# EAGLE board EtherTenR3 (EAGLE 6.2)
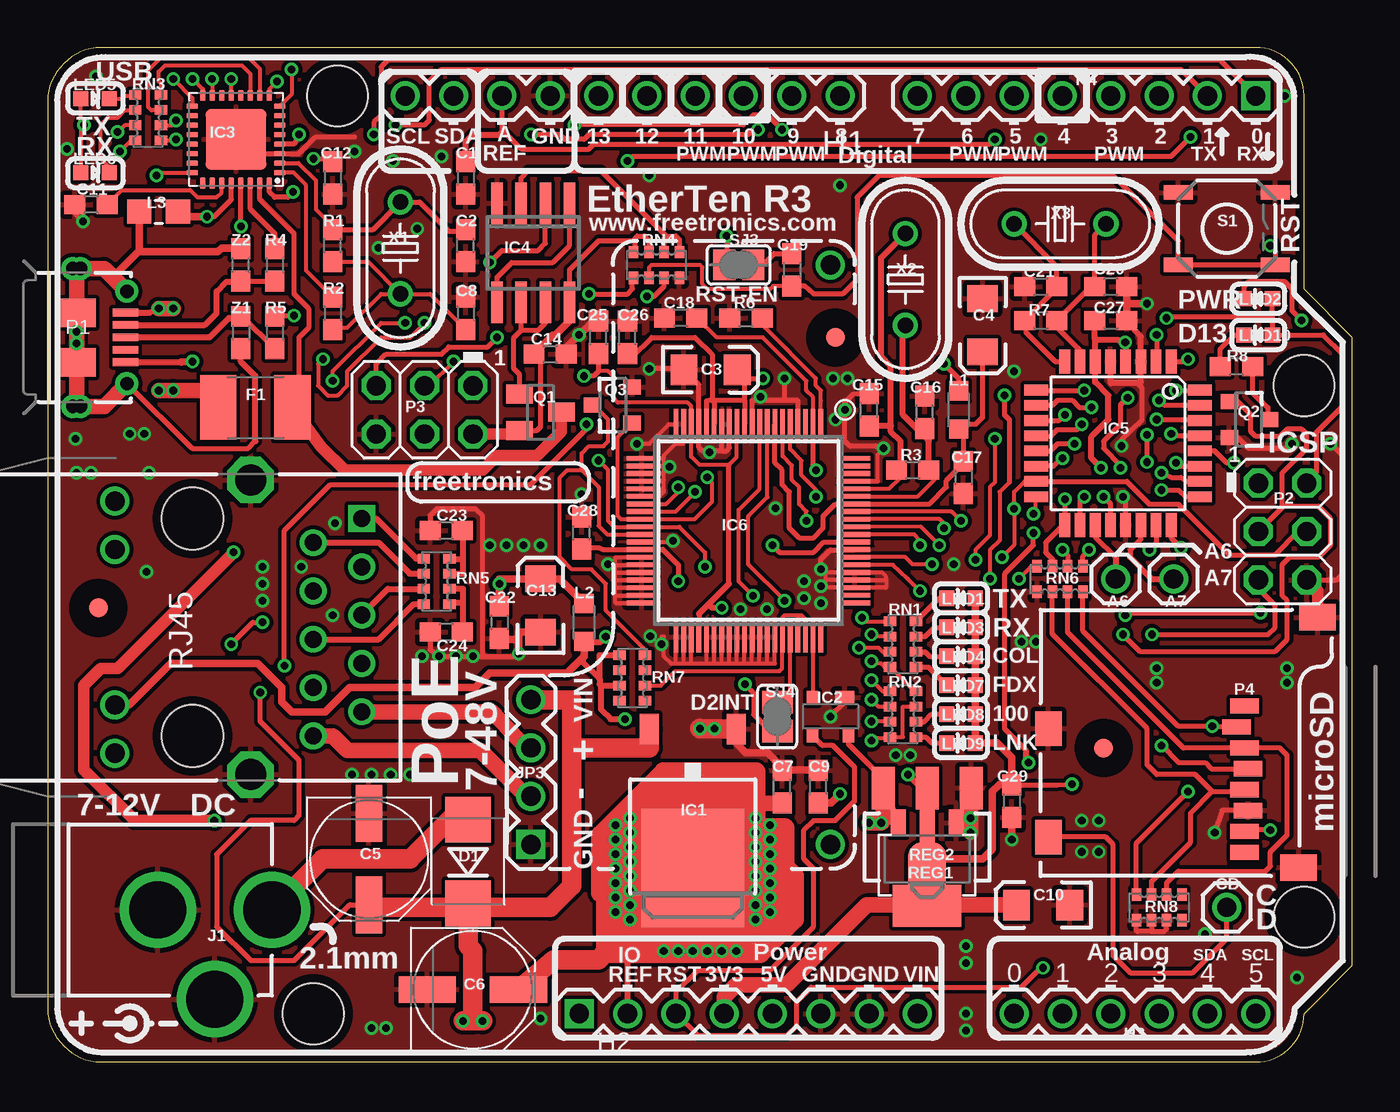
[diagram p1: board, top side]
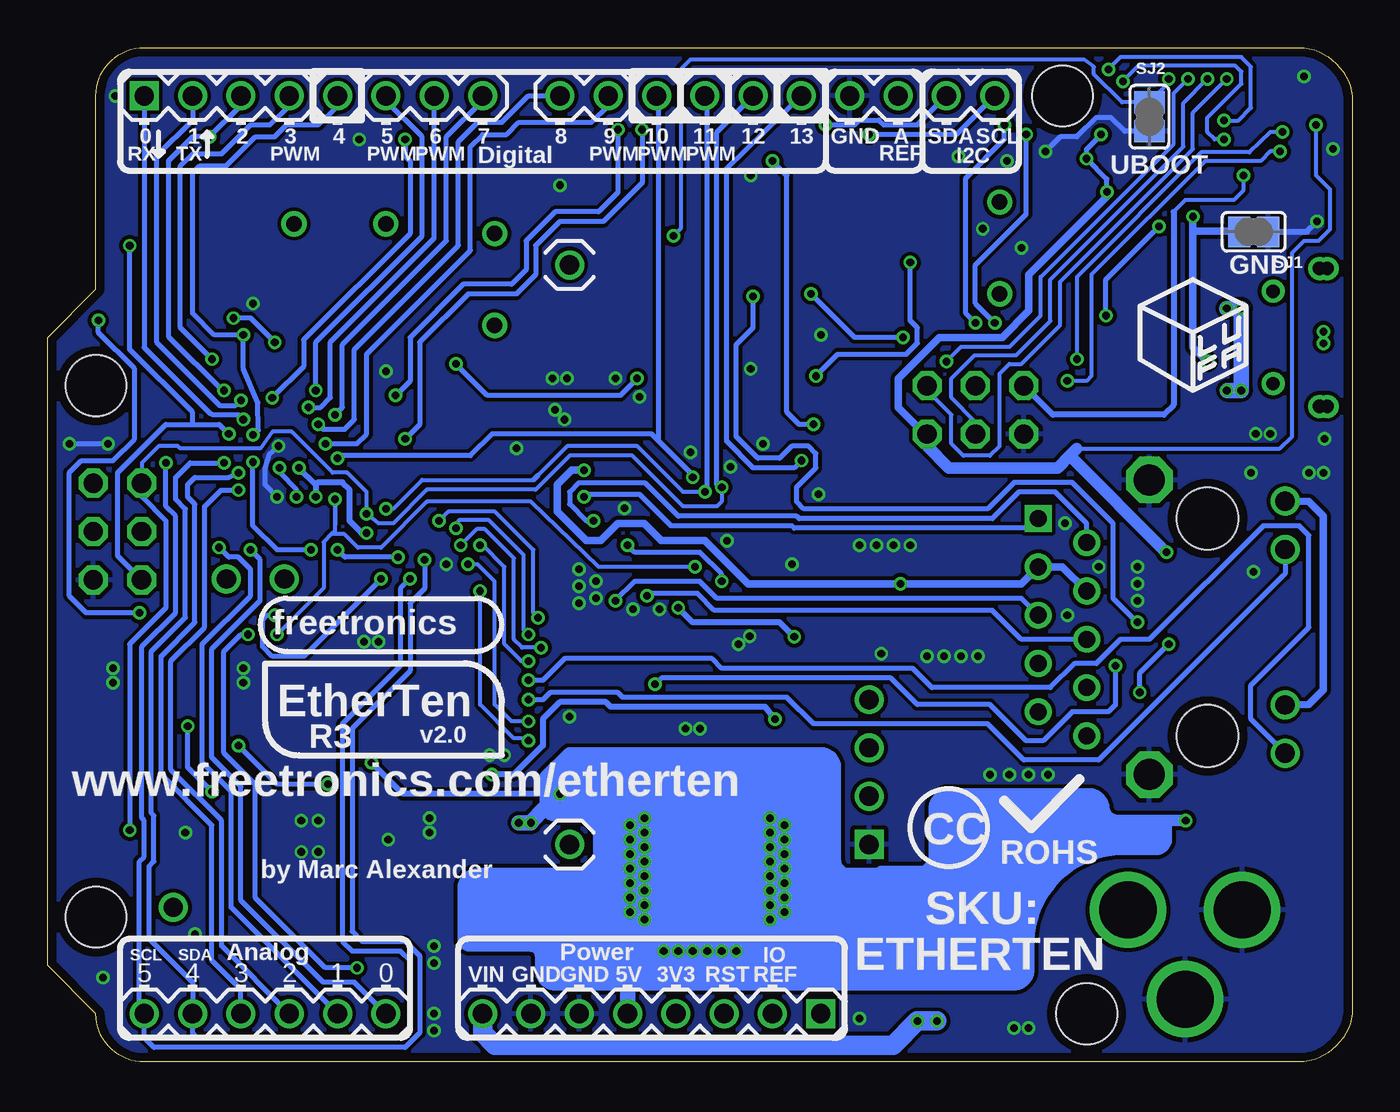
[diagram p2: board, bottom side, seen from below]

Size 68.58 x 53.34 mm. Coordinates in mm from the lower left corner, seen from the top.
Outline: 0,2.54 arc74 2.54,0 63.5,0 arc90 66.04,2.54 68.58,5.08 68.58,38.1 66.04,40.64 66.04,50.8 arc90 63.5,53.34 2.54,53.34 arc74 0,50.8 0,2.54
Copper layers (1*16): Top 0.035mm / dielectric 1.5mm / Bottom 0.035mm
Design rules: minimum track width 8mil, minimum drill 15mil, track to track 8mil, track to pad 8mil, pad to pad 8mil, via to via 8mil, smd to smd 8mil, copper to edge 18mil, drill to drill 8mil, minimum pad ring 10mil, minimum via ring 6mil, stop-mask expansion 4mil, vias tented up to drill 25mil, thermal gap 10mil
Holes 3.2 mm at 66.04,35.56 66.04,7.62 13.97,2.54 15.24,50.8
tRestrict: area 40.4,37.1 to 42.4,39.1; area 54.5,15.5 to 56.5,17.5; area 1.7,22.9 to 3.7,24.9

## Footprints (pad centres in the part's own frame; a part is rotated, then mirrored left to right if it is on the bottom)
1X01 = drill 1.016: 1 0,0
0603 = smd 1.1 x 1: 1 -0.85,0; 2 0.85,0
EIA3216 = smd 1.4 x 1.6: A 1.4,0; C -1.4,0
PANASONIC_D = smd 3 x 1.4: + 2.4,0; - -2.4,0
SMB-DIODE = smd 2.4 x 2.4: A 2.2,0; C -2.2,0
L1812 = smd 1.9 x 3.4: 1 -1.95,0; 2 1.95,0
FIDUCIAL-1X2.5 = smd 1 x 1: 1 0,0
1X10 = drill 1.016: 1 0,0; 2 2.54,0; 3 5.08,0; 4 7.62,0; 5 10.16,0; 6 12.7,0; 7 15.24,0; 8 17.78,0; 9 20.32,0; 10 22.86,0
1X08 = drill 1.016 square: 1 0,0 | drill 1.016: 2 2.54,0; 3 5.08,0; 4 7.62,0; 5 10.16,0; 6 12.7,0; 7 15.24,0; 8 17.78,0
1X06 = drill 1.016: 1 0,0; 2 2.54,0; 3 5.08,0; 4 7.62,0; 5 10.16,0; 6 12.7,0
DPACK = smd 1 x 1.6: 1 -2.28,-4.8; 3 2.28,-4.8 | smd 5.4 x 6.2: 2 0,2.5
SOT143-R = smd 1 x 0.7: 1 -0.75,-1 | smd 0.6 x 0.7: 2 0.95,-1; 3 0.95,1; 4 -0.95,1
ATMEL_QFN32 = smd 0.6 x 0.3: 1 -2.3,1.75; 2 -2.3,1.25; 3 -2.3,0.75; 4 -2.3,0.25; 5 -2.3,-0.25; 6 -2.3,-0.75; 7 -2.3,-1.25; 8 -2.3,-1.75; 17 2.3,-1.75; 18 2.3,-1.25; 19 2.3,-0.75; 20 2.3,-0.25; 21 2.3,0.25; 22 2.3,0.75; 23 2.3,1.25; 24 2.3,1.75 | smd 0.3 x 0.6: 9 -1.75,-2.3; 10 -1.25,-2.3; 11 -0.75,-2.3; 12 -0.25,-2.3; 13 0.25,-2.3; 14 0.75,-2.3; 15 1.25,-2.3; 16 1.75,-2.3; 25 1.75,2.3; 26 1.25,2.3; 27 0.75,2.3; 28 0.25,2.3; 29 -0.25,2.3; 30 -0.75,2.3; 31 -1.25,2.3; 32 -1.75,2.3 | smd 3.2 x 3.2: EXP 0,0
SO08 = smd 0.6 x 2.2: 1 -1.905,-2.6; 2 -0.635,-2.6; 3 0.635,-2.6; 4 1.905,-2.6; 5 1.905,2.6; 6 0.635,2.6; 7 -0.635,2.6; 8 -1.905,2.6
TQFP32-08 = smd 1.27 x 0.559: 1 -4.293,2.8; 2 -4.293,2; 3 -4.293,1.2; 4 -4.293,0.4; 5 -4.293,-0.4; 6 -4.293,-1.2; 7 -4.293,-2; 8 -4.293,-2.8; 17 4.293,-2.8; 18 4.293,-2; 19 4.293,-1.2; 20 4.293,-0.4; 21 4.293,0.4; 22 4.293,1.2; 23 4.293,2; 24 4.293,2.8 | smd 0.559 x 1.27: 9 -2.8,-4.293; 10 -2,-4.293; 11 -1.2,-4.293; 12 -0.4,-4.293; 13 0.4,-4.293; 14 1.2,-4.293; 15 2,-4.293; 16 2.8,-4.293; 25 2.8,4.293; 26 2,4.293; 27 1.2,4.293; 28 0.4,4.293; 29 -0.4,4.293; 30 -1.2,4.293; 31 -2,4.293; 32 -2.8,4.293
SQFP80 = smd 1.6 x 0.25: 1 -5.6,3.8; 2 -5.6,3.4; 3 -5.6,3; 4 -5.6,2.6; 5 -5.6,2.2; 6 -5.6,1.8; 7 -5.6,1.4; 8 -5.6,1; 9 -5.6,0.6; 10 -5.6,0.2; 11 -5.6,-0.2; 12 -5.6,-0.6; 13 -5.6,-1; 14 -5.6,-1.4; 15 -5.6,-1.8; 16 -5.6,-2.2; 17 -5.6,-2.6; 18 -5.6,-3; 19 -5.6,-3.4; 20 -5.6,-3.8; 41 5.6,-3.8; 42 5.6,-3.4; 43 5.6,-3; 44 5.6,-2.6; 45 5.6,-2.2; 46 5.6,-1.8; 47 5.6,-1.4; 48 5.6,-1; 49 5.6,-0.6; 50 5.6,-0.2; 51 5.6,0.2; 52 5.6,0.6; 53 5.6,1; 54 5.6,1.4; 55 5.6,1.8; 56 5.6,2.2; 57 5.6,2.6; 58 5.6,3; 59 5.6,3.4; 60 5.6,3.8 | smd 0.25 x 1.6: 21 -3.8,-5.6; 22 -3.4,-5.6; 23 -3,-5.6; 24 -2.6,-5.6; 25 -2.2,-5.6; 26 -1.8,-5.6; 27 -1.4,-5.6; 28 -1,-5.6; 29 -0.6,-5.6; 30 -0.2,-5.6; 31 0.2,-5.6; 32 0.6,-5.6; 33 1,-5.6; 34 1.4,-5.6; 35 1.8,-5.6; 36 2.2,-5.6; 37 2.6,-5.6; 38 3,-5.6; 39 3.4,-5.6; 40 3.8,-5.6; 61 3.8,5.6; 62 3.4,5.6; 63 3,5.6; 64 2.6,5.6; 65 2.2,5.6; 66 1.8,5.6; 67 1.4,5.6; 68 1,5.6; 69 0.6,5.6; 70 0.2,5.6; 71 -0.2,5.6; 72 -0.6,5.6; 73 -1,5.6; 74 -1.4,5.6; 75 -1.8,5.6; 76 -2.2,5.6; 77 -2.6,5.6; 78 -3,5.6; 79 -3.4,5.6; 80 -3.8,5.6
POWER_JACK_PTH = drill 2.997: GND 0,7.7; GNDBREAK 4.7,10.7; PWR 0,13.7
FT-POE-MODULE-NOLABEL = drill 1.016 square: 1 0,0 | drill 1.016: 2 2.54,0; 3 5.08,0; 4 7.62,0; MNT1 0,-15.748; MNT2 30.48,-15.748
L2012C = smd 1 x 1: 1 -1,0; 2 1,0
0805-LARGE = smd 1.27 x 1.27: 1 -1.016,0; 2 1.016,0
LED-0603 = smd 0.8 x 0.8: A 0,-0.75; C 0,0.75
USB-MICROB-MB05PMXX = smd 0.4 x 1.35: D+ 0,2.575; D- -0.65,2.575; GND 1.3,2.575; ID 0.65,2.575; VBUS -1.3,2.575 | smd 1.5 x 2: FIX1 -1.3,0; FIX2 1.3,0 | drill 0.7: PIN1 -2.425,2.65; PIN2 2.425,2.65; SLOT1 -3.625,-0.2; SLOT2 3.625,-0.2; TAB1 -3.625,0.2; TAB2 3.625,0.2
2X03 = drill 1.016 octagon: 1 -2.54,-1.27; 2 -2.54,1.27; 3 0,-1.27; 4 0,1.27; 5 2.54,-1.27; 6 2.54,1.27
MICRO-SD-SOCKET-PP = smd 0.8 x 1.5: 1 -8.94,10.7; 2 -7.84,10.3; 3 -6.74,10.7; 4 -5.64,10.9; 5 -4.54,10.7; 6 -3.44,10.9; 7 -2.34,10.7; 8 -1.24,10.7 | smd 1.8 x 1.4: CD1 -2.05,0.4; CD2 -7.75,0.4 | smd 1.4 x 1.9: GND1 -0.45,13.55; GND2 -13.6,14.55
SOT23 = smd 1 x 1.4: 1 -0.95,-1.1; 2 0.95,-1.1; 3 0,1.1
SOT23-3 = smd 0.8 x 0.9: 1 -0.95,-1; 2 0.95,-1; 3 0,1.1
SOT89 = smd 0.8 x 1.4: 1 -1.524,-1.905; 3 1.524,-1.905 | smd 0.8 x 1.9: 2 0,-1.651 | smd 2.032 x 3.65: 4 0,0.94
SOT223 = smd 1.219 x 2.235: 1 -2.311,-3.099; 2 0,-3.099; 3 2.311,-3.099 | smd 3.6 x 2.2: 4 0,3.099
CAY16 = smd 0.5 x 0.65: 1 -1.2,-0.675; 2 -0.4,-0.675; 3 0.4,-0.675; 4 1.2,-0.675; 5 1.2,0.675; 6 0.4,0.675; 7 -0.4,0.675; 8 -1.2,0.675
TACTILE_SWITCH_SMD = smd 1.524 x 0.762: 1 -2.54,1.905; 2 2.54,1.905; 3 -2.54,-1.905; 4 2.54,-1.905
SJ = smd 1.168 x 1.6: 1 -0.762,0; 2 0.762,0
HY931147C = drill 1.63 octagon: GND1 3.05,7.745; GND2 3.05,-7.745 | drill 0.9 square: P$1 8.89,5.715 | drill 0.9: P$2 6.35,4.445; P$3 8.89,3.175; P$4 6.35,1.905; P$5 8.89,0.635; P$6 6.35,-0.635; P$7 8.89,-1.905; P$8 6.35,-3.175; P$9 8.89,-4.445; P$10 6.35,-5.715 | drill 1.016: P$11 -4.08,6.625; P$12 -4.08,4.085; P$13 -4.08,-4.085; P$14 -4.08,-6.625 | hole 3.25: 0,5.715; 0,-5.715
HC49U-V = drill 0.813: 1 -2.413,0; 2 2.413,0

## Placement (x,y rotation side)
A6  M01PTH  [1X01]  56.13,25.4 0 top
A7  M01PTH  [1X01]  59.18,25.4 0 top
C1  100nF 0603  [0603]  21.97,46.48 270 top
C2  22pF 0603  [0603]  21.97,42.93 90 top
C3  10uF 6.3V A TANT  [EIA3216]  34.85,36.4 0 top
C4  10uF 6.3V A TANT  [EIA3216]  49.15,38.73 270 top
C5  47uF 25V  [PANASONIC_D]  16.89,10.67 270 top
C6  47uF 25V  [PANASONIC_D]  22.35,3.81 0 top
C7  100nF 0603  [0603]  38.61,14.48 90 top
C8  22pF 0603  [0603]  21.97,39.37 270 top
C9  1uF 0603  [0603]  40.51,14.48 90 top
C10  10uF 6.3V A TANT  [EIA3216]  52.32,8.26 180 top
C11  1uF 0603  [0603]  2.29,45.09 180 top
C12  100nF 0603  [0603]  14.99,46.48 270 top
C13  10uF 6.3V A TANT  [EIA3216]  25.91,24 90 top
C14  100nF 0603  [0603]  26.42,37.21 0 top
C15  13pF  [0603]  43.18,34.29 90 top
C16  13pF  [0603]  46.1,34.16 90 top
C17  100nF  [0603]  48.13,30.73 270 top
C18  10nF  [0603]  33.27,39.12 180 top
C19  100nF 0603  [0603]  39.12,41.66 270 top
C20  22pF 0603  [0603]  55.88,40.77 180 top
C21  22pF 0603  [0603]  52.2,40.77 0 top
C22  100nF  [0603]  23.75,23.11 270 top
C23  100nF  [0603]  20.95,27.94 180 top
C24  100nF  [0603]  20.95,22.61 180 top
C25  100nF  [0603]  28.96,38.1 90 top
C26  100nF  [0603]  30.48,38.1 90 top
C27  100nF 0603  [0603]  55.88,38.99 0 top
C28  100nF  [0603]  28.07,27.81 90 top
C29  100nF 0603  [0603]  50.67,13.72 270 top
CD  M01PTH  [1X01]  61.98,8.13 0 top
D1  1N4004 SMB  [SMB-DIODE]  22.1,10.54 90 top
F1  500mA PTC 1812  [L1812]  10.92,34.42 0 top
FID1  FIDUCIAL1X2.5  [FIDUCIAL-1X2.5]  41.4,38.1 0 top
FID2  FIDUCIAL1X2.5  [FIDUCIAL-1X2.5]  55.5,16.51 0 top
FID3  FIDUCIAL1X2.5  [FIDUCIAL-1X2.5]  2.67,23.88 0 top
H1  Digital_8_13  [1X10]  41.66,50.8 180 top
H2  Power  [1X08]  27.94,2.54 0 top
H3  Analog  [1X06]  50.8,2.54 0 top
H4  Digital_0_7  [1X08]  63.5,50.8 180 top
IC1  MC33269DT-5.0  [DPACK]  33.91,12.7 180 top
IC2  APX811-44UG-7  [SOT143-R]  41.15,18.16 180 top
IC3  ATMEGA16U2-MU  [ATMEL_QFN32]  9.91,48.51 180 top
IC4  LM358D  [SO08]  25.53,42.55 180 top
IC5  ATMEGA328P TQFP32  [TQFP32-08]  56.26,32.53 270 top
IC6  W5100SQFP80  [SQFP80]  36.83,27.94 270 top
J1  DC_2_1MM  [POWER_JACK_PTH]  -1.91,8 270 top
JP3  FT-POE-MODULE3  [FT-POE-MODULE-NOLABEL]  25.4,11.43 90 top
L1  1uH 250mA 0805  [L2012C]  47.88,34.29 270 top
L2  1uH 250mA 0805  [L2012C]  28.19,23.11 90 top
L3  0805 INDUCTOR  [0805-LARGE]  5.84,44.7 0 top
LED1  YELLOW  [LED-0603]  48.01,24.38 90 top
LED2  PWR/BLUE  [LED-0603]  63.63,40.13 90 top
LED3  YELLOW  [LED-0603]  48.01,22.86 90 top
LED4  RED  [LED-0603]  48.01,21.34 90 top
LED5  TX/YEL  [LED-0603]  2.5,50.65 270 top
LED6  RX/GRN  [LED-0603]  2.5,46.76 270 top
LED7  GREEN  [LED-0603]  48.01,19.81 90 top
LED8  GREEN  [LED-0603]  48.01,18.29 90 top
LED9  YELLOW  [LED-0603]  48.01,16.76 90 top
LED10  D13/RED  [LED-0603]  63.63,38.23 90 top
P1  USB-6PSMT  [USB-MICROB-MB05PMXX]  1.52,38.1 270 top
P2  ICSP:MAIN  [2X03]  64.91,27.89 270 top
P3  ICSP:USB  [2X03]  19.81,34.29 180 top
P4  microSD  [MICRO-SD-SOCKET-PP]  52.2,9.78 270 top
Q1  FDN340P  [SOT23]  25.91,34.16 270 top
Q2  2N7002  [SOT23-3]  63.12,33.78 270 top
Q3  2N7002  [SOT23-3]  29.72,34.54 90 top
R1  1M 0603  [0603]  14.99,42.93 90 top
R2  27R 0603  [0603]  14.99,39.37 270 top
R3  1M  [0603]  45.47,31.11 0 top
R4  22R 0603  [0603]  11.94,41.91 270 top
R5  22R 0603  [0603]  11.94,38.35 270 top
R6  12K3 1%  [0603]  36.7,39.12 0 top
R7  1M 0603  [0603]  52.2,38.99 0 top
R8  1K 0603  [0603]  62.48,36.58 180 top
REG1  LD1117-SOT89  [SOT89]  46.23,10.67 180 top
REG2  LD1117-SOT223  [SOT223]  46.23,11.3 180 top
RN1  1K  [CAY16]  44.96,21.97 270 top
RN2  1K  [CAY16]  44.96,18.29 270 top
RN3  1K  [CAY16]  5.28,49.66 270 top
RN4  10K  [CAY16]  32,41.91 0 top
RN5  49R9 1%  [CAY16]  20.45,25.27 270 top
RN6  1K  [CAY16]  53.21,25.4 0 top
RN7  1K  [CAY16]  30.73,20.19 90 top
RN8  2K2  [CAY16]  58.42,8.13 0 top
S1  RESET  [TACTILE_SWITCH_SMD]  61.98,43.81 0 top
SJ1  GROUND  [SJ]  5.19,43.66 0 bottom
SJ2  UBOOT  [SJ]  10.67,49.7 90 bottom
SJ3  RESET-EN  [SJ]  36.32,41.91 0 top
SJ4  D2_INT  [SJ]  38.35,18.16 90 top
U1  HY931147C-RJ45  [HY931147C]  7.62,22.86 0 top
X1  16MHz  [HC49U-V]  18.54,42.8 90 top
X2  25MHz  [HC49U-V]  45.09,41.15 270 top
X3  16MHz  [HC49U-V]  53.21,44.07 0 top
Z1  PGB1010603  [0603]  10.16,38.35 270 top
Z2  PGB1010603  [0603]  10.16,41.91 90 top

## Tracks (layer width: path | path; a pad name or v marks a point on that pad's centre or on a via)
1V8_OUT  (via drill 0.4)
  Top 0.254: C26.1 30.73,37.08 31.75,38.1 34.04,38.1 34.92,37.21 34.92,34.77 | 34.92,34.77 34.63,34.76 IC6.16 | 36.63,34.8 IC6.11 | 36.63,34.8 36.63,36.14 C3.A 36.7,35.94 v37.59,35.94 | 34.9,34.8 35.03,34.8 | 35.03,34.8 36.63,34.8 | IC6.15 35.03,34.8 | L1.1 47.88,35.94 v47.12,36.7 | 34.92,34.77 34.9,34.8 | 34.9,34.8 34.8,34.8
  Bottom 0.254: v37.59,35.94 38.48,35.05 45.47,35.05 v47.12,36.7
1V8A
  Top 0.254: C4.A 49.15,33.91 48.77,33.53 48.12,33.53 L1.2 48.13,33.04 C17.1 48.13,31.46 47.24,30.57 47.24,30.23 46.36,29.34 IC6.74 41.4,29.34 40.77,28.7 40.77,28.07 40.26,27.56 39.5,27.56 38.99,28.07 38.99,29.97 38.61,30.35 38.61,31.11 38.23,31.49 IC6.7
1V8OUT  (via drill 0.4)
  Top 0.254: IC6.69 40.8,27.34 40.26,26.8 38.48,26.8 v38.1,27.18 | v33.15,25.27 33.15,26.14 32.33,26.95 IC6.33 29.19,26.94 28.96,27.05 28.32,27.05 C28.1
  Bottom 0.254: v38.1,27.18 37.72,26.8 34.29,26.8 33.15,25.65 v33.15,25.27
3V3A  (via drill 0.4)
  Top 0.203: IC6.2 40.23,33.57 40.23,34.95 39.88,35.31 39.88,35.81 37.59,38.1 35.18,38.1 C18.1
  Top 0.254: IC6.2 40.23,31.27 v40.39,31.11
  Top 0.406: L2.2 26.92,25.4 25.27,25.4 C13.A 23.75,25.4 | v23.75,25.15 23.75,25.4 | 23.75,25.4 C22.1
  Bottom 0.406: U1.P$4 15.24,26.04 U1.P$3 17.4,25.15 v23.75,25.15 31.75,25.15 34.04,27.43 36.32,27.43 37.21,28.32 38.61,28.32 39.5,27.43 40.26,27.43 41.78,28.96 41.78,30.35 41.02,31.11 v40.39,31.11
3V3D  (via drill 0.4)
  Top 0.203: 28.96,36.32 29.46,36.32 29.72,36.07 29.72,34.92 29.97,34.67 33.66,34.67 33.83,34.5 IC6.18 33.83,31.83 34.27,31.39 35.81,31.39 36.22,31.8 IC6.12 | 34.24,23.57 34.24,23.52
  Top 0.254: 34.24,23.52 IC6.44 | 35.81,25.15 35.81,31.39 | P4.4 61.16,15.42 60.83,15.75 59.44,15.75 v58.55,16.64 | v53.85,14.61 53.05,14.57 C29.1 | IC4.2 26.16,43.05 25.78,42.67 23.88,42.67 v23.24,42.04 | v28.19,36.07 28.7,36.07 28.96,36.32 C25.1
  Top 0.305: 34.73,24.07 34.24,23.57 | 34.73,24.07 35.81,25.15 | 29.08,19.81 30.04,19.81 RN7.7 | 29.02,20.13 28.13,21.02 28.13,21.27 | RN7.5 29.02,21.39 29.02,20.13 | REG1.4 REG2.4 | 28.19,22.1 29.08,22.1 v29.34,22.35 | v35.43,23.88 34.92,23.88 34.73,24.07 | 29.08,19.81 29.02,19.88 29.02,20.13 | 29.08,19.81 29.08,18.54 29.59,18.03 v30.35,18.03 | v45.21,15.11 45.97,14.35 REG2.2
  Top 0.406: LED1.A LED3.A LED4.A LED7.A LED8.A LED9.A 49.91,16.76 50.67,16 C29.1 50.63,14.61 50.04,14.61 49.66,14.22 49.66,11.18 49.15,10.67 46.23,10.67 | 46.23,10.67 REG1.4 | 46.23,10.67 REG1.2 REG2.2 | U1.P$13 4.3,18.77 6.48,20.95 11.05,20.95 12.32,19.68 12.32,18.92 12.83,18.41 14.61,18.41 15.88,19.68 22.48,19.68 23.24,20.45 27.3,20.45 28.13,21.27 28.19,21.34 28.19,22.1 L2.1
  Top 0.813: REG2.4 46.18,8.26 C10.A 43.05,8.25 41.27,6.48 38.86,4.06 36.2,4.06 35.56,3.43 H2.4
  Bottom 0.254: v58.55,16.64 56.52,14.61 v53.85,14.61 | v23.24,42.04 23.24,38.99 22.86,38.61 22.86,37.8 23.44,37.21 27.05,37.21 v28.19,36.07
  Bottom 0.305: v29.34,22.35 30.1,23.11 34.67,23.11 v35.43,23.88 | v30.35,18.03 30.86,18.67 38.99,18.67 39.24,18.92 41.66,18.92 42.55,18.03 42.55,16.64 44.07,15.11 v45.21,15.11
  Bottom 0.406: U1.P$13 2.29,18.8 1.52,19.56 1.52,28.7 2.29,29.46 U1.P$11
5V  (via drill 0.4)
  Top 0.203: 1.75,49.28 LED5.A | 1.75,49.28 LED6.A | v1.91,49.28 1.75,49.28 | IC1.2 34.04,10.2 34.04,10.16 | 37.21,13.59 37.08,13.59 v37.21,12.83 | 37.85,12.45 v37.97,12.45 37.97,12.32
  Top 0.254: IC3.4 12.95,48.26 v13.21,48.77 | IC3.32 11.66,45.75 11.94,45.47 12.62,45.47 v12.9,45.74 | REG2.3 43.92,14.88 42.1,16.7 IC2.4 | 64.38,39.19 LED10.A 67.06,38.23 68.07,37.21 68.07,34.48 66.67,33.08 66.67,30.99 66.18,30.49 P2.2 | 64.38,39.19 LED2.A | IC5.18 54.26,29.5 v54.48,29.72 | RN4.7 31.6,43.2 31.37,43.43 30.99,43.43 30.86,43.31 30.86,43.18 | 30.86,43.18 30.86,42.64 RN4.8 | IC4.8 27.43,41.66 28.96,43.18 30.86,43.18 | C14.1 25.91,36.87 25.91,33.4 25.72,33.21 Q1.2 | 64.38,39.19 58.85,39.19 v58.8,39.12 | v56.64,37.85 56.64,37.83 56.53,37.72 | 29.84,10.41 v29.84,10.16 | 29.72,9.78 29.84,9.65 v29.84,9.4 | v29.84,8.64 v29.84,7.87 | 30.23,8.64 29.97,8.64 | 36.45,6.48 36.7,6.48 36.83,6.35 36.45,6.35 | v13.97,47.5 14.82,47.5 C12.1 | v51.82,27.81 51.82,27.18 50.29,25.65 50.29,17.53 51.44,16.38 51.44,16.26
  Top 0.305: IC5.4 56.66,37.59 56.53,37.72 56.26,37.97 55.12,37.97 | 55.12,37.97 55.03,38.06 C27.1 | 55.12,37.97 55.06,37.92 IC5.6 55.06,35.74 55.75,35.05 55.75,33.78 54.86,32.89 54.86,31.75 v55.37,31.24 | 51.44,16.26 51.44,15.88 v51.56,15.75 | H2.2 30.48,5.59 28.96,5.59 | 28.96,5.08 28.7,5.08 28.7,5.59 28.96,5.59 | 28.96,5.08 28.96,5.37 28.96,5.59 | 28.96,5.08 29,5.08
  Top 0.406: REG2.3 REG1.3 | 38.57,13.59 C7.1 | C9.1 41.19,13.63 v41.66,14.1 | IC4.8 27.43,38.99 26.67,38.23 26.54,38.23 25.57,37.25 C14.1
  Top 0.61: Q1.2 24.61,33.02 P3.2 | v9.78,26.8 3.68,20.7 2.79,20.7 1.91,19.81 1.91,15.37 4.57,12.7 v8.76,12.7 | v36.2,5.84 v35.43,5.84 v34.67,5.84 v33.91,5.84 v33.15,5.84 v32.38,5.84 | v36.2,5.84 36.2,6.1 36.45,6.1 | 36.45,6.48 36.45,6.35 36.45,5.84 v36.2,5.84 | 30.23,10.67 30.23,10.54 v30.61,10.54
  Top 0.813: 37.21,13.59 38.57,13.59 | v30.61,7.49 v30.61,10.54 v30.61,12.83 30.86,12.83 | v37.21,7.49 v37.21,8.26 v37.21,9.02 37.21,12.32 v37.21,12.83 | REG2.3 43.92,12.68 v43.81,12.57 v43.18,12.57
  Top 1.016: C6.+ 26.6,5.37 28.96,5.37 30.23,6.86 | IC1.2 30.23,6.86 | 34.04,15.24 34.04,10.16 | 34.04,15.24 32.38,15.24 29.08,11.94 29.08,8.89 29.34,9.78 | 29.34,9.78 29.34,5.71 37.21,5.71 | 37.21,5.71 37.21,12.32 | 37.21,12.32 37.21,13.59 37.21,15.24 34.04,15.24 | 29.34,9.78 29.72,9.78 30.86,10.92 30.86,12.83 32.64,14.61 36.45,14.61 36.45,6.48 30.23,6.48 30.23,6.86 | 30.23,6.86 30.23,8.64 30.99,9.4 30.99,6.99 35.94,6.99 35.94,13.84 32.26,13.84 32,13.59 36.07,13.59 | 29.84,10.41 29.84,12.19 30.23,12.19 30.23,10.67 | 37.21,5.71 37.47,5.71 39.24,7.49 39.24,9.78 38.73,10.29 38.73,12.32 38.61,12.32 | 37.97,12.32 38.61,12.32 | 37.21,12.32 37.97,12.32 | 37.97,12.32 v37.97,11.68 v37.97,10.92 v37.97,10.16 v37.97,9.4 v37.97,8.64 v37.97,7.87 37.97,6.73 | 38.61,12.32 38.61,6.99 | v29.84,8.64 31.24,10.41 29.97,10.41 29.97,8.64 v29.84,8.64
  Bottom 0.203: v1.91,49.28 1.91,46.61 1.17,45.87 1.17,43.79 1.78,43.18 2.54,43.18 3.17,42.55 3.17,32.89 3.81,32.26 14.48,32.26
  Bottom 0.254: v54.48,29.72 54.48,30.1 | v41.66,14.1 41.7,14.1 42.16,13.63 42.16,13.84 42.29,13.97 42.29,14.35 | v58.8,39.12 57.91,39.12 v56.64,37.85 | 42.42,13.34 42.44,13.35 | 42.29,13.21 42.16,13.34 | 40.26,14.73 40.39,14.86 40.64,14.86 | P3.2 22.48,33.02 | 21.97,12.7 21.84,12.57 21.84,12.45 | 21.84,11.94 21.97,11.81 21.97,11.56 21.84,11.56 | 21.97,11.18 21.84,11.18 | 21.97,10.92 21.84,10.79 21.84,10.41 | 15.11,10.41 17.02,10.29 15.62,10.03 15.88,9.78 15.88,9.65 16.26,9.27 16.51,9.02 16.51,8.89 | 17.27,8.13 17.27,7.87 | 21.21,14.1 21.21,13.84 | v29.84,11.68 v29.84,12.45 | v29.84,10.92 30.23,10.54 v30.61,10.54 | 36.83,6.35 35.69,6.35 35.56,6.48 | v12.9,45.74 12.9,46.43 v13.97,47.5 13.97,48.01 v13.21,48.77
  Bottom 0.305: 54.48,30.35 v55.37,31.24 | 54.48,30.35 v54.48,29.72 | 54.48,30.35 54.36,30.48 53.09,30.48 52.7,30.1 52.7,28.45 52.07,27.81 v51.82,27.81 | v51.56,15.75 49.91,14.1 v41.66,14.1
  Bottom 0.406: 22.48,33.02 23.88,34.42 23.88,35.94 21.72,38.1 18.41,38.1 17.02,39.5 17.02,41.4 12.9,45.49 v12.9,45.74
  Bottom 0.61: 14.86,31.88 15.49,31.24 21.21,31.24 22.35,32.38 P3.2 | 14.86,31.88 14.48,32.26 | v9.78,26.8 14.86,31.88 | 9.78,12.7 9.78,11.81 arc90 10.29,11.18 11.81,11.18 arc-90 17.02,6.35 | 17.02,6.35 17.45,9.86 | 17.45,9.86 19.81,7.49 v30.61,7.49 | 41.17,16.26 41.1,16.08 | 42.42,13.46 42.42,13.34 42.29,13.21 42.16,13.08 39.5,13.08 | 42.29,14.35 42.16,14.48 | 42.16,14.48 40.77,15.88 | 42.16,13.84 40.64,15.37 | 42.16,13.34 40.64,14.86 | 40.26,14.73 41.78,13.21 | 17.45,9.86 26.37,9.86 arc90 27.18,10.67 27.18,15.49 arc-90 27.94,16.26 41.17,16.26 | 41.17,16.26 42.42,15.01 42.42,13.46 | 42.42,13.46 arc-90 41.91,12.95 40.64,12.95 arc90 39.62,11.94 39.62,11.68 | 39.62,11.18 39.62,10.92 arc90 40.64,9.91 45.97,9.91 arc-90 46.74,9.14 | 42.67,5.59 42.67,4.83 arc-90 41.91,4.06 17.78,4.06 arc-90 17.02,4.83 17.02,5.08 | 46.74,6.48 arc-90 46.35,6.1 43.18,6.1 | 46.74,6.99 46.74,7.49 | 46.74,8.13 46.74,8.64 | 17.02,6.1 17.02,5.59 | 17.02,6.6 17.02,7.11 | 17.02,7.62 17.02,9.14 | 17.02,9.14 arc-90 17.78,9.91 27.18,9.91 | 27.18,9.91 27.94,9.91 | 27.94,9.91 27.94,7.48 | 17.02,9.14 46.74,9.14 | 46.74,9.14 46.74,8.64 | 46.74,8.64 17.27,8.64 17.27,8.13 46.74,8.13 | 46.74,7.49 46.74,8.13 | 17.02,7.62 46.74,7.49 | 17.02,7.11 17.02,7.62 | 17.02,7.11 46.74,6.99 | 46.74,6.48 46.74,6.99 | 17.02,6.6 46.74,6.48 | 17.02,6.35 17.02,6.6 | 17.02,6.35 17.02,6.1 | 17.02,6.1 43.18,6.1 | 43.18,6.1 arc90 42.67,5.59 | 17.02,5.59 42.67,5.59 | 17.02,5.59 17.02,5.08 | 17.02,5.08 42.42,5.08 42.42,4.57 17.53,4.57 17.27,7.87 | 17.27,7.87 17.14,9.53 | 17.14,9.53 42.16,9.4 42.16,9.65 39.62,9.65 39.62,9.91 27.94,9.91 | 27.18,9.91 27.18,10.16 39.62,10.16 39.62,10.67 27.43,10.67 27.43,11.18 39.62,11.18
  Bottom 0.61: 39.62,11.18 39.62,11.68 | 39.62,11.68 v29.84,11.68 27.43,11.68 27.43,12.19 39.37,12.19 39.37,12.45 | 39.37,12.45 39.62,12.45 | 39.37,12.45 v29.84,12.45 27.43,12.45 27.43,12.95 39.62,12.95 39.62,13.46 27.43,13.46 27.43,13.97 42.16,13.97 42.16,14.48 | 42.16,14.48 27.43,14.48 27.43,14.99 41.91,14.99 41.91,15.24 41.15,15.24 | 41.15,15.24 27.43,15.24 27.43,15.75 41.15,15.75 41.15,15.24 | 22.99,9.91 arc-90 21.97,10.92 21.97,11.18 21.97,11.56 21.97,12.7 | 21.97,13.34 21.97,12.95 | 21.97,12.95 21.97,12.7 | 21.97,13.34 arc90 21.21,14.1 13.84,14.1 arc90 13.08,13.34 13.08,13.46 arc-90 12.32,12.7 9.78,12.7 | v8.76,12.7 9.78,12.7 | 13.46,13.84 21.21,13.84 21.46,13.84 | 21.97,13.34 13.34,13.34 | 21.97,12.95 12.95,12.95 | 21.97,12.7 12.57,12.7 | 21.84,12.45 10.03,12.45 | 21.84,11.94 10.03,11.94 | 21.84,11.56 10.16,11.56 | 21.84,11.18 13.59,11.18 | 21.84,10.79 14.48,10.79 | 15.11,10.41 21.84,10.41 21.97,10.41 | 15.62,10.03 24.77,10.03 | 17.14,9.53 46.48,9.53 | 17.27,7.87 46.61,7.87 | 15.88,9.65 23.62,9.65 | 16.26,9.27 24,9.27 | 16.51,8.89 24.26,8.89
  Bottom 0.813: 38.1,6.6 37.97,6.6 v37.21,7.49 v37.21,8.26 v37.21,9.02 | v30.61,7.49 v30.61,8.26 v30.61,9.02 v30.61,9.78 v30.61,10.54 v30.61,11.3 | v30.61,12.06 v30.61,12.83 30.73,11.68 30.86,11.56 30.86,11.3 | v37.21,12.83 v37.21,12.06 v37.21,11.3 v37.21,10.54 v37.21,9.78 | v37.21,12.83 37.08,13.59 37.21,13.72 v37.21,12.83 | 43.22,12.57 v43.81,12.57 | 43.22,12.57 v43.18,12.57 | 43.22,12.57 42.44,13.35 42.16,13.63 37.88,13.63 v37.21,12.83 | H2.5 38.1,6.35 36.83,6.35 36.45,6.35
  Bottom 1.016: 36.83,6.35 36.7,6.35 v36.2,5.84
A0  (via drill 0.4)
  Top 0.254: v57.91,26.92 58.29,27.3 58.29,28.2 IC5.23
  Bottom 0.254: H3.1 52.45,4.19 54.1,4.19 58.42,8.51 58.42,14.48 59.94,16 59.94,21.72 57.4,24.26 57.4,26.42 v57.91,26.92
A1  (via drill 0.4)
  Top 0.254: v59.56,27.05 59.06,27.55 IC5.24
  Bottom 0.254: H3.2 58.93,8.13 58.93,14.22 60.45,15.75 60.45,21.97 57.91,24.51 57.91,25.91 58.55,26.54 59.05,26.54 v59.56,27.05
A2  (via drill 0.4)
  Top 0.254: IC5.25 59.81,29.73 59.46,30.07 v58.55,30.07
  Bottom 0.254: H3.3 59.44,6.1 59.44,12.7 62.1,15.37 62.1,21.08 60.33,22.86 60.33,29.21 59.46,30.07 v58.55,30.07
A3  (via drill 0.4)
  Top 0.254: IC5.26 59.87,30.53 59.56,30.73 59.05,30.73 v58.55,30.99
  Bottom 0.254: H3.4 58.42,3.81 59.94,5.33 59.94,12.45 62.61,15.11 62.61,21.34 60.83,23.11 60.83,29.34 61.21,29.72 61.21,30.35 60.83,30.73 59.05,30.73 v58.55,30.99
A4_SDA  (via drill 0.4)
  Top 0.203: 50.55,30.48 50.04,29.97 50.04,27.43 49.53,26.92 v49.53,25.4
  Top 0.254: IC5.27 59.48,31.33 v59.31,31.5 | v50.29,35.05 50.29,34.04 50.55,33.78 50.55,30.48 | v38.61,49.02 37.85,49.78 37.08,49.78 36.58,49.28 v27.69,49.28
  Bottom 0.254: H1.9 22.86,49.28 24.64,49.28 24.89,49.53 25.91,49.53 26.16,49.28 v27.69,49.28 | v59.31,31.5 61.09,31.5 61.85,30.73 61.85,29.59 61.34,29.08 61.34,23.37 63.12,21.59 63.12,13.08 62.99,12.95 62.99,10.54 63.25,10.29 63.25,6.48 60.96,4.19 H3.5 60.96,1.52 60.71,1.27 50.04,1.27 49.53,1.78 49.53,5.33 50.04,5.84 52.58,5.84 53.09,6.35 53.09,17.78 50.04,20.83 50.04,24.89 v49.53,25.4 | v38.61,49.02 38.61,45.72 39.62,44.7 41.91,44.7 43.43,43.18 43.43,41.66 44.2,40.89 46.74,40.89 49.53,38.1 49.53,35.81 v50.29,35.05
A5_SCL  (via drill 0.4)
  Top 0.203: v49.78,32.77 49.78,30.48 49.53,30.23 49.53,27.69 48.77,26.92 v48.77,26.42
  Top 0.254: IC5.28 61.34,32.13 61.98,31.5 v62.36,31.5 | v37.34,49.02 37.08,49.02 36.83,48.77 28.45,48.77 28.19,48.51 27.18,48.51 26.92,48.77 v25.4,48.77
  Bottom 0.254: v62.36,31.5 62.36,29.21 61.85,28.7 61.85,23.62 63.63,21.84 63.63,12.83 63.5,12.7 63.5,10.79 63.75,10.54 63.75,2.79 H3.6 63.5,1.27 62.99,0.76 49.78,0.76 49.02,1.52 49.02,5.59 49.78,6.35 52.07,6.35 52.58,6.86 52.58,17.53 49.53,20.57 49.53,24.13 48.77,24.89 v48.77,26.42 | H1.10 20.83,48.77 25.15,48.77 | v37.34,49.02 37.34,46.23 39.37,44.2 41.66,44.2 42.93,42.93 42.93,41.4 43.94,40.39 46.48,40.39 49.02,37.85 49.02,33.53 v49.78,32.77
  Bottom 0.305: 25.15,48.77 v25.4,48.77
AREF  (via drill 0.4)
  Top 0.254: IC5.20 55.86,29.36 v55.5,29.72 | v56.39,31.24 56.39,31.37 55.5,32.26 55.5,32.64 56.39,33.53 56.39,34.54 v56.77,34.92 | v49.78,48.51 49.53,48.26 28.7,48.26 28.45,48.01 24.89,48.01 23.88,49.02 | H1.8 23.88,49.02 | 23.88,49.02 23.88,48.9
  Top 0.305: C1.1 21.97,48.39 22.35,48.77 23.75,48.77 23.88,48.9
  Bottom 0.254: v55.5,29.72 55.5,30.1 56.39,30.99 v56.39,31.24 | v56.77,34.92 55.12,36.58 55.12,37.97 49.53,43.56 49.53,47.37 49.78,47.62 v49.78,48.51
COLLED  (via drill 0.4)
  Top 0.203: IC6.71 45.9,28.14 v46.86,27.18 | RN1.3 43.88,21.57 43.66,21.79 v42.65,21.79
  Bottom 0.203: v42.65,21.79 43.64,21.79 44.07,22.23 44.07,26.49 45.59,28.02 46.02,28.02 v46.86,27.18
D0_RX  (via drill 0.4)
  Top 0.203: RN3.4 4.39,48.46 v3.81,47.88 | v14.99,35.81 14.99,36.32 17.53,38.86 v18.8,38.86
  Top 0.254: IC5.30 60.5,33.78 v58.29,33.78 | H4.1 61.59,52.7 17.91,52.7 17.53,52.32 17.53,49.78 17.14,49.4 v17.14,48.77
  Bottom 0.203: v3.81,47.88 4.32,47.88 4.83,47.37 7.75,47.37 13.72,41.4 13.72,36.07 13.97,35.81 v14.99,35.81
  Bottom 0.254: H4.1 63.5,37.56 60.05,34.11 59.87,34.04 58.55,34.04 v58.29,33.78 | v17.14,48.77 17.14,44.58 19.81,41.91 19.81,39.88 v18.8,38.86
D1_TX  (via drill 0.4)
  Top 0.203: RN3.3 4.04,49.26 v3.68,48.9 | v14.48,36.96 14.22,36.7 14.22,35.56 14.73,35.05 15.24,35.05 15.75,35.56 15.75,36.32 17.53,38.1 19.05,38.1 v19.81,38.86
  Top 0.254: IC5.31 60.54,34.54 58.67,34.54 v58.42,34.8 | H4.2 59.56,52.2 20.7,52.2 20.07,51.56 20.07,49.53 19.81,49.28 v18.29,49.28
  Bottom 0.203: v3.68,48.9 4.32,48.9 5.41,47.83 7.95,47.83 14.48,41.27 v14.48,36.96
  Bottom 0.254: H4.2 60.96,49.53 62.87,47.62 62.87,37.85 59.54,34.53 58.69,34.53 v58.42,34.8 | v19.81,38.86 20.32,39.37 20.32,46.48 18.29,48.51 v18.29,49.28
D2  (via drill 0.4)
  Top 0.254: IC5.32 60.53,35.31 v59.31,35.31 | v60.07,48.64 59.05,47.62 30.73,47.62 v30.48,47.37 | v28.32,33.53 28.32,33.27 25.4,30.35 14.86,30.35 12.45,27.94 v12.45,20.83 | SJ4.1 37.97,17.4 37.11,18.26 37.11,19.41 v36.65,19.86
  Bottom 0.254: H4.3 58.42,50.29 v60.07,48.64 60.96,48.64 62.23,47.37 62.23,38.15 59.41,35.33 59.33,35.33 v59.31,35.31 | v30.48,47.37 29.72,46.61 29.72,34.16 29.08,33.53 v28.32,33.53 | v12.45,20.83 12.45,18.8 12.83,18.41 14.73,18.41 16.26,16.89 17.14,16.89 19.05,18.8 22.86,18.8 24.26,20.19 36.32,20.19 v36.65,19.86
D3  (via drill 0.4)
  Top 0.254: IC5.1 59.82,36.83 v59.94,36.96
  Bottom 0.254: v59.94,36.96 61.59,38.61 61.59,47.12 60.96,47.75 59.44,47.75 57.91,49.28 56.9,49.28 55.88,50.29 H4.4
D4  (via drill 0.4)
  Top 0.254: v58.29,38.23 58.29,36.85 IC5.2 | RN6.5 54.41,26.6 v54.74,26.92 | v57.78,31.55 v57.78,32.97
  Bottom 0.254: H4.5 53.34,50.29 54.36,49.28 56.01,49.28 56.64,48.64 57.66,48.64 59.18,47.12 60.58,47.12 60.96,46.74 60.96,39.37 59.82,38.23 v58.29,38.23 58.29,36.45 57.53,34.67 57.51,33.22 v57.78,32.97 | v54.74,26.92 56.52,26.92 57.78,28.19 v57.78,31.55
D5  (via drill 0.4)
  Top 0.254: IC5.9 51.99,35.31 v54.48,35.31
  Bottom 0.254: v54.48,35.31 54.48,37.85 48.9,43.43 48.9,48.64 50.8,50.55 H4.6
D6  (via drill 0.4)
  Top 0.254: IC5.10 51.98,34.54 52.83,34.54 53.09,34.8 53.85,34.8 54.23,34.42 v54.86,34.42
  Bottom 0.254: v54.86,34.42 54.23,34.42 53.72,34.92 53.72,37.85 48.26,43.31 H4.7
D7  (via drill 0.4)
  Top 0.254: IC5.11 53.16,33.73 v53.47,34.04
  Bottom 0.254: H4.8 45.72,50.55 47.62,48.64 47.62,43.18 53.09,37.72 53.09,34.42 v53.47,34.04
D8  (via drill 0.4)
  Top 0.254: IC5.12 52.7,32.89 53.06,33.25 54.12,33.26 v54.36,33.53
  Bottom 0.254: H1.1 43.31,50.8 44.7,49.4 45.97,49.4 46.99,48.39 46.99,42.93 52.45,37.47 52.45,33.78 52.96,33.27 54.1,33.27 v54.36,33.53
D9  (via drill 0.4)
  Top 0.254: IC5.13 52.7,32.13 53.09,32.51 v53.98,32.51
  Bottom 0.254: v53.98,32.51 52.32,32.51 51.82,33.02 51.82,37.21 46.35,42.67 46.35,48.13 45.72,48.77 44.45,48.77 43.81,49.4 40.01,49.4 39.12,50.29 H1.2
D10_SS  (via drill 0.4)
  Top 0.203: v34.67,30.73 34.67,30.71 34.92,30.45 34.92,29.46 34.01,28.54 IC6.29 30.13,28.54 29.97,28.7 29.97,32.85 Q3.1
  Top 0.254: IC5.14 52.87,31.33 v53.34,31.75
  Bottom 0.254: 36.45,32.64 36.83,33.02 45.21,33.02 46.35,31.88 53.21,31.88 v53.34,31.75 | v34.67,30.73 34.67,30.86 36.45,32.64 | H1.3 36.45,50.67 36.45,32.64
D11_MOSI  (via drill 0.4)
  Top 0.203: IC6.28 33.01,28.94 33.02,28.96 v34.04,29.97 | IC5.15 51.36,30.53 50.8,29.97 v50.8,29.08 50.8,27.18 v50.16,26.54
  Top 0.254: IC5.15 56.72,30.53 57.91,29.34 59.44,29.34 62.1,26.67 64.52,26.67 | 64.52,26.67 64.58,26.67 | 64.52,26.67 65.74,27.89 P2.4 | RN6.6 53.61,26.65 v53.34,26.92
  Bottom 0.203: v34.04,29.97 35.18,29.97 37.59,32.38 41.27,32.38 42.8,30.86 | v50.8,29.08 50.42,29.08 48.9,30.61 43.05,30.61
  Bottom 0.254: v53.34,26.92 52.96,26.54 v50.16,26.54 | H1.4 33.91,50.67 33.91,30.23 34.04,30.1 v34.04,29.97 | 43.05,30.61 42.8,30.86
D12_MISO  (via drill 0.4)
  Top 0.203: IC6.27 32.52,29.34 33.15,29.97 v33.15,30.23 | v51.82,28.83 51.94,28.96 51.94,29.7 IC5.16
  Top 0.254: P4.7 62.9,12.16 62.87,12.19 v64.26,12.19
  Bottom 0.203: v33.15,30.23 33.15,29.46 33.4,29.21 35.18,29.21 37.85,31.88 41.15,31.88 42.93,30.1 48.64,30.1 50.42,28.32 51.18,28.32 v51.82,28.83 51.82,29.97 52.83,30.99 53.59,30.99 55.75,33.15 56.77,33.15 57.4,32.26 61.59,32.26 61.72,32.38 62.74,32.38 63.63,31.5 63.63,30.44 P2.1
  Bottom 0.254: v64.26,12.19 64.26,21.97 62.36,23.88 62.36,28.45 63.64,29.73 P2.1 | H1.5 33.4,48.9 33.4,30.35 33.15,30.1 v33.15,30.23
D13_SCK  (via drill 0.4)
  Top 0.203: v34.54,26.04 34.54,26.8 33.2,28.14 IC6.30 29.77,28.14 29.46,28.45 29.46,31.11 v28.96,31.62
  Top 0.254: P2.3 64.9,29.15 64.9,29.21 | 64.9,29.21 64.9,30.99 66.17,32.26 66.17,33.02 65.91,33.27 65.15,33.27 64.77,32.89 63.5,32.89 63.25,33.15 63.25,34.04 62.55,34.73 Q2.1 | 53.46,28.32 52.45,27.3 52.45,26.8 52.83,26.42 52.83,26.09 RN6.7 | v53.47,29.59 v53.46,29.59 53.46,28.32 | 53.46,28.32 IC5.17 | 64.9,29.21 66.8,29.21 67.44,28.57 67.44,27.18 66.8,26.54 65.28,26.54 64.9,26.16 64.9,24.51 65.15,24.26 65.15,22.23 64.52,21.59 57.4,21.59 v56.52,22.48
  Bottom 0.203: v34.54,26.04 39.62,26.04 43.18,29.46 48.64,29.46 51.05,27.05 52.28,27.05 52.98,27.75 53.66,27.75 | v56.52,22.48 54.08,24.92 54.08,27.33 53.66,27.75 | 53.66,27.75 53.47,27.94 v53.47,29.59 arc91 53.46,29.46 IC5.17
  Bottom 0.254: v28.96,31.62 29.34,31.24 31.5,31.24 32.89,32.64 32.89,46.99 H1.6
DTR  (via drill 0.4)
  Top 0.203: IC3.13 v9.66,51.69 v9.65,51.69 | 35.69,42.04 SJ3.1
  Top 0.254: v35.69,43.43 35.69,42.04
  Bottom 0.203: v9.65,51.69 9.65,51.49 SJ2.2 12.11,50.46 13.59,51.94 13.59,52.32 14.1,52.7 34.8,52.7 35.31,52.2 35.31,43.81 v35.69,43.43
FDXLED  (via drill 0.4)
  Top 0.203: IC6.70 45.54,27.74 45.85,27.43 v45.85,27.18 | RN1.4 44.13,20.77 | v43.31,21.08 43.43,20.95 43.81,20.95 44,20.77 RN1.4 | RN2.8 45.57,19.49 RN1.4
  Bottom 0.203: v43.31,21.08 43.69,21.08 44.58,21.97 44.58,26.04 45.72,27.18 v45.85,27.18
GND  (via drill 0.4)
  Top 0.203: IC6.32 32.89,27.34 | 33.83,20.95 IC6.43 | 29.84,25.34 IC6.37 | 29.84,25.34 29.84,25.74 | IC6.34 29.84,26.54 29.84,26.14 | 29.84,26.14 IC6.35 | 29.84,25.74 IC6.36 | 29.84,25.74 29.84,26.14 | 32.26,22.35 32.38,22.35 32.38,21.34 32.77,20.95 33.02,20.95 | 33.02,20.95 33.43,20.95 | 33.43,20.95 33.83,20.95 | 44.07,25.4 44.07,24.94 IC6.63 40.89,24.94 40.89,25.78 | 44.07,25.4 44.07,25.53 43.86,25.74 IC6.65 40.81,25.74 arc-90 v40.64,25.91 | 44.07,25.4 arc-90 44.01,25.34 IC6.64 40.89,25.34 40.89,25.4 | IC6.54 38.23,20.95 37.82,20.95 | 33.83,20.95 34.65,20.95 | 34.65,20.95 35.03,20.95 | 35.03,20.95 35.43,20.95 | 35.43,20.95 35.84,20.95 | 35.84,20.95 36.22,20.95 | 36.22,20.95 36.63,20.95 | 36.63,20.95 37.01,20.95 | 37.01,20.95 37.41,20.95 | 37.41,20.95 37.82,20.95 | IC6.53 37.82,20.95 | IC6.52 37.41,22.34 37.41,20.95 | IC6.51 37.01,22.34 37.01,20.95 | IC6.50 36.63,20.95 | IC6.49 36.22,20.95 | IC6.48 35.84,20.95 | IC6.47 35.43,20.95 | IC6.46 35.03,20.95 | IC6.45 34.65,22.34 34.65,20.95 | IC6.42 33.43,20.95 | IC6.41 33.02,20.95 | 29.84,24.94 IC6.38 | 29.84,24.94 29.84,25.34 | 29.84,24.54 IC6.39 | 29.84,24.54 29.84,24.94 | IC6.40 29.84,24.14 29.84,24.54 | IC6.26 32.15,29.74 32.38,29.97 32.38,30.1 | 32.38,30.1 31.27,30.1 IC6.25 | 32.38,30.1 32.38,30.61 | 32.38,30.61 32.38,30.99 | 32.38,30.99 32.38,31.24 | 32.38,31.24 32.38,31.75 | 32.38,31.75 IC6.21 | IC6.22 32.29,31.34 arc-90 32.38,31.24 | IC6.23 32.34,30.94 arc90 32.38,30.99 | IC6.24 32.32,30.54 arc90 32.38,30.61 | IC6.20 33.03,32.52 arc-90 33.02,32.51 | 33.02,32.51 33.4,32.51 33.4,33.51 arc-90 IC6.19 | 32.38,31.75 32.38,31.88 33.02,32.51 | v30.99,32.51 31.62,32.51 32.64,33.53 33.02,33.53 | IC3.3 12.19,47.75
  Top 0.203: 43.62,30.54 43.62,31.94 v43.94,32.26
  Top 0.254: IC6.4 39.43,34.74 39.42,34.8 38.74,34.8 | IC6.77 43.62,30.54 | v31.62,36.45 33.14,36.45 C3.C 34.23,35.62 IC6.17 34.23,32.32 34.42,32.13 35.43,32.13 | IC6.13 35.84,33.52 35.84,32.28 35.69,32.13 35.43,32.13 | IC6.14 35.43,33.51 35.43,32.13 | 43.81,32.13 43.56,32.38 42.16,32.38 41.91,32.64 41.91,34.67 42.38,35.14 C15.2 | 38.74,34.8 37.03,34.8 IC6.10 | IC6.68 42.41,26.92 41.15,26.92 40.64,26.42 v40.64,25.91 | IC3.3 10.66,47.76 IC3.EXP | 12.19,47.75 13.21,47.75 14.1,48.64 16.13,48.64 | C11.2 1.44,44.66 v1.85,44.2 | C24.2 20.11,21.68 20.45,21.34 v22.35,21.34 22.99,21.34 | 22.99,21.34 24.64,21.34 v24.77,21.46 | C23.2 20.11,28.74 20.45,29.08 22.48,29.08 22.86,28.7 22.86,21.46 22.99,21.34 | REG1.1 47.75,12.83 48.51,13.59 48.51,14.38 REG2.1 | RN8.1 57.22,6.92 57.28,6.86 58.02,6.86 | RN8.3 58.8,7.43 58.8,6.99 58.67,6.86 58.02,6.86 | RN8.2 58.02,6.86 | P4.6 61.73,13.22 v61.34,12.06 | Q2.2 62.55,32.83 63.12,32.26 65.15,32.26 v65.41,32.51 | IC5.21 56.66,29.57 v56.52,29.72 | IC2.1 41.9,18.91 v41.15,18.16 | v56.44,32.38 56.44,32.72 57.53,33.78 57.53,35.43 57.28,35.69 | v67.44,32.51 68.07,31.88 68.07,25.65 67.77,25.35 P2.6 | v38.73,35.94 v38.74,35.94 38.74,34.8
  Top 0.305: IC5.5 55.88,36.8 55.88,35.69 57.28,35.69 57.4,35.69 57.46,35.74 IC5.3 57.46,38.13 56.77,38.86 C27.2
  Top 0.406: C13.C 24.77,22.6 24.77,22.35 | v24.77,21.46 24.77,22.35 | 23.75,22.23 24.64,22.23 24.77,22.35 | v50.67,11.68 C29.2 | C27.2 56.73,39.88 | 56.73,39.88 C20.1 | 56.73,39.88 v57.78,39.88 | 38.61,15.37 38.61,15.49 37.85,16.26 36.7,16.26 36.2,16.76 IC1.1 | 38.61,15.37 C7.2 | 38.61,15.37 40.47,15.37 C9.2 | C14.2 27.27,37.55 28.57,38.86 28.87,38.86 C25.2
  Top 0.61: 66.8,23.37 66.75,23.42 66.75,24.78 P2.6
  Top 0.813: 48.51,13.59 v48.51,12.83 v48.51,12.06
  Top 1.016: IC1.1 34.32,17.5 v34.29,17.53
  Bottom 0.254: v56.52,29.72 57.15,30.35 57.15,31.24 56.9,32 v56.44,32.38 | SJ2.1 11.98,48.94 12.7,49.66 13.46,49.66 14.48,48.64 15.37,48.64 v16.13,47.88 | v67.44,32.51 v65.41,32.51
  Bottom 0.305: SJ1.2 2.39,43.66 v1.85,44.2
  other vias: 65.66,4.45 48.26,2.54 58.29,20.7 58.29,19.94 28.07,29.84 20.7,47.62 2.54,51.82 1.47,32.77 4.32,33.02 5.08,33.02 44.58,16.13 45.34,16.13 35.05,17.53 27.94,38.23 31.62,46.61 41.66,46.1 1.52,30.99 2.29,30.99 5.33,30.99 1.02,48.01 51.18,22.1 51.94,22.1 65.15,20.7 65.15,19.94 47.62,26.16 50.8,36.32 65.02,50.8 52.2,48.51 19.43,43.81 5.21,25.78 48.26,1.65 25.91,2.29 48.26,5.21 48.26,6.1 29.46,26.16 25.91,27.18 41.27,35.94 55.24,11.05 55.24,12.7 34.8,32.05 41.91,34.29 37.47,34.98 32.69,31.29 36.42,23.8 37.82,23.8 38.25,29.11 32.87,27.41 40.64,25.02 40.64,24.13 39.75,25.27 39.75,24.38 25.02,27.18 24.13,27.18 23.24,27.18 15.11,28.32 13.34,26.04 14.99,23.5 11.3,26.04 11.3,25.15 11.3,24.26 42.04,35.94 41.4,33.78 32.26,21.97 31.67,22.38 21.46,21.34 20.57,21.34 19.68,21.34 19.05,15.11 18.03,15.11 17.02,15.11 16,15.11 54.36,11.05 54.36,12.7 17.4,42.8 18.16,47.37 60.83,6.73 17.02,1.78 17.78,1.78
  pour Bottom: 0,50.8 arc-74 2.54,53.34 63.5,53.34 arc-74 66.04,50.8 66.04,40.64 68.58,38.1 68.58,5.08 66.04,2.54 arc-74 63.5,0 2.54,0 arc-74 0,1.91
  pour Top: 0,50.8 arc-74 2.54,53.34 63.5,53.34 arc-74 66.04,50.8 66.04,40.64 68.58,38.1 68.58,5.08 66.04,2.54 arc-74 63.5,0 2.54,0 arc-74 0,1.91
INT
  Top 0.203: SJ4.2 39.03,19.47 IC6.56
LINKLED  (via drill 0.4)
  Top 0.203: IC6.66 44.42,26.14 45.21,25.4 v45.85,24.77 | 44.28,17.02 43.43,17.02 v43.31,16.89 | RN2.7 44.96,18.69 44.96,17.09 RN2.4 44.28,17.02 | 44.28,17.02 44.32,17.02
  Bottom 0.203: v43.31,16.89 43.43,17.02 44.07,17.02 45.85,18.8 v45.85,24.77
MISO2  (via drill 0.4)
  Top 0.203: IC3.17 7.61,50.69 v6.6,51.69
  Bottom 0.203: v6.6,51.69 8.38,49.91 8.38,48.01 15.37,41.02 15.37,38.73 17.4,36.7 18.03,36.7 18.54,36.2 18.54,32.38 19.05,31.88 20.45,31.88 21.08,32.51 21.08,34.04 22.35,35.31 P3.1
MOSI2  (via drill 0.4)
  Top 0.203: IC3.16 8.16,51.15 v7.62,51.69
  Bottom 0.203: v7.62,51.69 8.89,50.42 8.89,48.13 15.88,41.15 15.88,38.96 17.68,37.16 19.86,37.16 21.08,35.94 21.08,34.92 19.81,33.66 P3.4
N$1
  Top 0.305: RN5.6 21.84,24.87 21.84,24.13 | 21.84,24.13 21.12,24.13 RN5.5 | C24.1 21.84,22.61 21.84,24.13
N$2
  Top 0.254: IC5.7 54.26,37.43 53.05,38.65 R7.2 54.83,40.77 C20.2 55.03,43.47 X3.2
N$3
  Top 0.254: SJ3.2 37.59,41.91 38.19,42.51 C19.1
N$4
  Top 0.254: R8.2 61.63,37.5 62.36,38.23 LED10.C
N$6
  Top 0.254: R8.1 63.33,35.17 64.14,34.42 64.14,33.87 Q2.3
N$7
  Top 0.254: IC5.8 52.97,36.82 51.44,38.35 51.44,38.9 R7.1 53.05,40.69 C21.2 53.05,41.82 X3.1
N$8
  Top 0.203: IC3.1 12.93,46.76 13.59,46.1 13.59,41.62 R2.1
N$9  (via drill 0.4)
  Top 0.254: 10.16,37.08 Z1.2 | 10.92,32.64 10.54,32.26 7.59,32.26 P1.PIN2
  Top 0.305: 10.92,32.64 10.92,36.07 10.16,36.83 Z1.2
  Top 0.406: Z2.2 10.12,42.8 9.14,42.8 8.95,42.6 4.83,42.6 | 4.83,42.6 L3.1 | 4.83,42.6 4.75,42.6 3.43,41.27 | P1.FIX1 1.52,39.37
  Top 0.813: P1.FIX1 1.52,41.52 P1.TAB1 2.97,41.73 3.43,41.27 P1.PIN1 | 1.52,39.37 v1.52,38.41 v1.52,37.8 P1.FIX2 1.52,34.67 P1.TAB2 2.97,34.48 P1.PIN2
N$10
  Bottom 0.406: 4.57,43.69 5.59,43.69
N$11
  Top 0.203: LED6.C 3.25,47.06 2.79,47.5 2.79,49.28 3.17,49.66 3.68,49.66 4.06,50.04 4.59,50.04 RN3.2
N$12
  Top 0.254: RN4.5 33.2,43.25 33.02,43.43 32.51,43.43 | 32.51,43.43 32.38,43.31 32.38,42.6 RN4.6 | 32.51,43.43 29.08,46.86 25.27,46.86 24.89,46.48 IC4.3
N$13
  Top 0.203: LED5.C 3.92,50.65 4.06,50.8 4.55,50.8 RN3.1
N$14  (via drill 0.4)
  Top 0.203: RN6.8 51.73,26.07 v51.05,25.4
  Top 0.254: LED2.C 62.88,40.78 63.12,41.02 65.02,41.02 65.41,40.64 65.41,39.5 v65.91,38.99 | v56.64,23.5 56.77,23.62 v63.75,23.62
  Bottom 0.254: v65.91,38.99 65.91,38.35 64.01,36.45 64.01,32.77 65.15,31.62 66.8,31.62 67.44,30.99 67.44,24.51 66.55,23.62 v63.75,23.62 | v56.64,23.5 57.02,23.5 57.28,23.24 57.28,21.84 56.77,21.34 55.12,21.34 v51.05,25.4
N$15
  Top 0.406: 35.81,41.91 36.83,41.91
N$16
  Top 0.254: Z1.1 10.24,39.2 R5.2
  Top 0.305: Z1.1 10.07,39.12 9.53,39.12 8.51,38.1 P1.D+
N$17
  Top 0.254: Z2.1 R4.2
  Top 0.305: Z2.1 10.12,41.02 9.4,41.02 8.89,40.51 8.89,39.37 8.27,38.75 P1.D-
N$18
  Top 0.254: 24.89,38.48 IC4.6 | 24.89,38.48 25.78,38.48 26.16,38.86 IC4.7 | 24.7,35.24 Q1.1 24.81,36.15 24.51,36.45 24.51,38.1 24.89,38.48
N$19
  Top 0.254: IC4.5 23.62,41.27 24.38,42.04 26.54,42.04 27.43,42.93 IC4.1
N$20  (via drill 0.4)
  Top 0.254: RN6.4 54.41,22.68 59.44,17.65 v61.21,17.65 62.46,17.65 P4.2 | RN8.8 57.22,11.5 v59.94,14.22
  Bottom 0.254: v59.94,14.22 61.21,15.49 v61.21,17.65
N$21
  Top 0.254: 56.9,26.54 56.9,26.92 57.46,27.5 IC5.22
  Top 0.305: 56.9,26.54 58.04,25.4 A7.1
N$22
  Top 0.254: 56.13,26.54 55.06,27.62 IC5.19
  Top 0.305: 56.13,26.54 A6.1
N$23
  Top 0.254: P4.CD1 55.61,11.83 56.01,11.43 56.01,5.59 56.9,4.7 60.2,4.7 61.98,6.48 CD.1
N$24
  Top 0.254: RN6.2 52.81,22.5 57.78,17.53 57.78,15.62 58.29,15.11 60.33,15.11 61.21,14.22 | 61.21,14.22 62.8,14.22 P4.5 | RN8.7 58.02,9.51 60.07,11.56 60.07,13.08 61.21,14.22
N$25
  Top 0.254: RN6.3 53.61,22.59 59.69,16.51 62.89,16.51 P4.3 64.77,16.51 65.15,16.13 65.15,11.94 64.26,11.05 64.26,10.29 64.01,10.03 59.44,10.03 58.82,9.42 RN8.6
N$26
  Top 0.254: RN2.6 46.08,17.89 46.48,18.29 LED8.C
N$27
  Top 0.203: RN7.2 32.24,19.79 32.99,20.55 38.46,20.55 38.61,20.7 38.61,22.32 IC6.55 38.63,23.39 38.73,23.5 39.43,23.5 | IC6.58 39.83,23.29 39.62,23.5 39.43,23.5 | 39.43,23.5 IC6.57
N$28
  Top 0.254: RN2.5 46.16,17.09 46.48,16.76 LED9.C
N$60
  Top 1.016: J1.PWR 14.46,10.67 19.05,10.67 21.38,12.99 D1.A
N$67  (via drill 0.4)
  Top 0.203: RN2.1 43.88,19.49 v43.31,20.07
  Bottom 0.254: U1.P$14 5.33,18.03 5.33,19.81 2.29,22.86 2.29,27.69 2.79,28.19 4.7,28.19 10.67,22.23 12.19,22.23 13.46,20.95 14.61,20.95 15.88,19.68 22.1,19.68 23.11,20.7 33.15,20.7 33.66,21.21 41.4,21.21 42.55,20.07 v43.31,20.07
N$68
  Top 0.813: U1.P$9 23.37,18.41 25.15,16.51 JP3.3
N$69
  Top 0.813: U1.P$10 14.99,17.14 15.75,16.38 22.73,16.38 25.15,13.97 JP3.2
N$113
  Top 0.203: IC3.2 13.19,47.26 14.1,46.35 14.1,44.83 14.99,43.94 R1.2
  Top 0.254: R1.2 17.11,43.78 X1.2 19.56,45.21 21.08,43.69 21.88,43.69 C2.2
N$114
  Top 0.203: R2.2 15.07,38.61 15.75,38.61 17.53,40.39 X1.1 | R1.1 16.85,42.08 X1.1 | X1.1 20.11,40.39 C8.2
N$115  (via drill 0.4)
  Top 0.305: P1.VBUS 5.36,39.4 v5.84,39.62
  Top 0.61: 8.85,35.31 F1.1
  Top 0.813: v5.84,35.31 v6.6,35.31 8.85,35.31 | v5.84,39.62 v6.6,39.62
  Bottom 0.813: 6.58,35.31 v5.84,35.31 v5.84,39.62 v6.6,39.62
N$117
  Top 0.203: 9.14,46.2 9.14,45.72 8.89,45.47 7.87,45.47 7.49,45.85 3.9,45.85 C11.1
  Top 0.254: 9.14,46.2 IC3.27
N$321
  Top 0.305: RN5.7 21.84,25.67 21.84,26.42 | 21.84,26.42 21.12,26.42 RN5.8 | C23.1 21.84,27.94 21.84,26.42
N$322
  Top 0.203: IC6.1 40.64,34.8 40.64,35.31 40.39,35.56 40.39,35.94 37.72,38.61 R6.2
N$327
  Top 0.254: RN1.5 46.3,20.77 LED7.C
N$328
  Top 0.254: RN1.6 46.12,21.57 46.35,21.34 LED4.C
N$329
  Top 0.254: RN1.7 46.12,22.37 46.61,22.86 LED3.C
N$330
  Top 0.254: RN1.8 46.85,24.38 LED1.C
N$332  (via drill 0.4)
  Top 0.203: RN2.2 43.67,18.69 v43.31,19.05
  Bottom 0.254: U1.P$12 3.54,25.67 3.68,25.53 13.34,15.88 17.27,15.88 19.18,17.78 28.32,17.78 29.72,19.18 38.35,19.18 38.61,19.43 42.16,19.43 42.55,19.05 v43.31,19.05
RD+  (via drill 0.4)
  Top 0.254: R5.1 11.98,39.24 v12.95,39.24 | v10.16,43.94 IC3.29
  Bottom 0.254: v12.95,39.24 12.95,41.15 v10.16,43.94
RD-
  Top 0.254: R4.1 11.98,42.84 11.99,42.85 11.96,43 11.96,43.54 10.66,44.84 IC3.30
RESET  (via drill 0.4)
  Top 0.203: RN4.2 31.6,41.76 31.75,41.91 34.29,41.91 34.42,41.78 34.42,40.89 34.67,40.64 37.97,40.64 38.14,40.81 C19.2
  Top 0.254: IC2.3 40.72,16.64 41.27,16.64 42.42,15.49 42.42,13.72 41.4,12.7 40.26,12.7 39.75,12.19 39.75,10.67 40.26,10.16 40.26,7.11 37.97,4.83 34.16,4.83 33.02,3.68 H2.3 34.16,1.4 38.86,1.4 39.37,1.91 39.37,3.17 40.13,3.94 51.18,3.94 52.2,4.95 v52.32,4.95 | IC5.29 59.22,32.93 v59.05,33.02 | v64.26,42.93 64.52,42.67 S1.4 S1.3 59.44,43.18 56.01,46.61 43.69,46.61 42.55,45.47 42.55,41.15 41.78,40.39 40.26,40.39 39.79,40.81 C19.2 | v58.04,22.48 64.14,22.48 64.52,22.86 64.52,24 63.63,24.89 63.63,25.34 P2.5
  Bottom 0.254: P2.5 64.9,26.61 64.9,30.99 62.36,33.53 60.96,33.53 | v64.26,42.93 64.26,37.47 60.96,34.16 60.96,33.53 | v52.32,4.95 53.98,4.95 57.66,8.64 57.66,14.61 59.31,16.26 59.31,21.59 58.42,22.48 v58.04,22.48 | v59.05,33.02 59.56,33.53 60.96,33.53
RESET2  (via drill 0.4)
  Top 0.203: IC3.24 5.87,46.76 v5.71,46.61
  Top 0.254: P3.5 17.27,36.7 17.78,37.21 20.7,37.21 21.08,37.59 23.11,37.59 v23.62,38.1 | v28.45,40.39 30.48,40.39 30.73,40.64 30.73,41.16 RN4.1
  Bottom 0.203: v5.71,46.61 5.71,45.85 6.22,45.34 8.76,45.34 9.4,44.7
  Bottom 0.254: v23.62,38.1 26.16,38.1 v28.45,40.39
  Bottom 0.305: 9.4,44.7 9.4,34.54 9.91,34.04 15.75,34.04 P3.5
RXIN  (via drill 0.4)
  Top 0.203: v39.88,28.45 39.88,28.96 39.5,29.34 39.5,30.23 39.12,30.61 39.12,31.37 38.63,31.86 IC6.6
  Top 0.305: U1.P$2 17.4,27.3 19.03,25.67 RN5.2
  Bottom 0.254: v39.88,28.45 40.26,28.45 41.15,29.34 41.15,29.97 40.69,30.43 37.16,30.43 35.43,28.7 29.21,28.7 29.08,28.57 18.92,28.57 17.53,29.97 15.62,29.97 13.97,28.32 U1.P$2
RXIP  (via drill 0.4)
  Top 0.203: v40.39,29.72 40.39,30.1 39.62,30.86 39.62,31.62 39.03,32.22 IC6.5
  Top 0.305: U1.P$1 17.27,28.57 19.37,26.47 RN5.1
  Bottom 0.254: v40.39,29.72 40.26,29.84 37.47,29.84 35.81,28.19 29.46,28.19 29.34,28.07 17.02,28.07 U1.P$1
RXLED
  Top 0.203: IC3.10 11.16,52.22 10.54,52.83 5.97,52.83 5.28,52.15 5.28,50.22 5.46,50.04 5.94,50.04 RN3.7
SCK2  (via drill 0.4)
  Top 0.203: IC3.15 8.66,51.67 v8.64,51.69 | P3.3 20.07,35.56 v21.34,36.83
  Bottom 0.203: v8.64,51.69 9.4,50.93 9.4,48.26 16.38,41.27 16.38,39.24 18.03,37.59 20.57,37.59 v21.34,36.83
SEN
  Top 0.203: IC6.31 29.41,27.74 28.96,28.19 28.96,30.23 28.07,31.11 | RN7.4 31.41,21.68 29.34,23.75 29.34,25.15 28.57,25.91 27.56,25.91 26.92,26.54 26.92,30.73 27.3,31.11 28.07,31.11 | Q3.3 28.7,34.54 29.46,33.78 29.46,32.64 29.21,32.38 28.45,32.38 28.07,32 28.07,31.11
SPDLED  (via drill 0.4)
  Top 0.203: IC6.67 45.09,26.54 45.47,26.16 v46.48,26.16 | 44.28,17.91 v43.31,17.91 | 44.28,17.91 44.34,17.91 | RN2.3 44.28,17.91
  Bottom 0.203: v43.31,17.91 44.2,17.91 45.09,18.8 45.09,25.27 45.97,26.16 v46.48,26.16
TXLED
  Top 0.203: IC3.11 10.66,51.95 10.21,52.4 6.17,52.4 5.84,52.07 5.84,51.56 5.97,51.44 5.97,50.87 RN3.8
TXON  (via drill 0.4)
  Top 0.203: IC6.9 37.43,30.14 36.32,29.03 36.32,25.27 v37.08,24.51
  Top 0.305: U1.P$6 17.4,22.23 19.25,24.07 RN5.4
  Bottom 0.254: U1.P$6 17.4,22.23 18.92,23.75 33.53,23.75 34.42,24.64 36.83,24.64 36.96,24.51 v37.08,24.51
TXOP  (via drill 0.4)
  Top 0.203: v38.73,24.26 36.83,26.16 36.83,28.7 37.83,29.7 IC6.8
  Top 0.305: U1.P$5 17.89,24.87 RN5.3
  Bottom 0.254: U1.P$5 17.4,24.38 33.4,24.38 34.29,25.27 37.72,25.27 v38.73,24.26
USBGND  (via drill 0.4)
  Top 0.254: IC3.28 9.66,45.34 8.76,44.45 v8.38,44.45
  Top 0.305: P1.GND 7.01,36.8
  Top 0.406: L3.2 6.86,44.45 v8.38,44.45 | 7.01,36.8 v7.62,36.83
  Bottom 0.406: v7.62,36.83 8.38,37.59 8.38,43.69 | 8.38,43.69 v8.38,44.45 | SJ1.1 5.99,43.69 8.38,43.69
USBRXD  (via drill 0.4)
  Top 0.203: RN3.5 6.69,48.46 v6.76,48.51 | IC3.9 11.66,51.15 v12.06,51.56
  Bottom 0.203: v12.06,51.56 11.25,52.38 6.15,52.38 5.84,52.07 5.84,51.44 7.62,49.66 7.62,48.9 7.24,48.51 v6.76,48.51
USBTXD  (via drill 0.4)
  Top 0.203: RN3.6 6.51,49.26 v6.76,49.51 | IC3.8 12.83,50.88 v12.83,52.2
  Bottom 0.203: v12.83,52.2 12.19,52.83 5.84,52.83 5.33,52.32 5.33,50.16 5.99,49.51 v6.76,49.51
USBVCC
  Top 0.254: IC3.31 11.16,45.36 12.95,43.56 12.95,40.39 13.72,39.62 13.72,38.61 13.21,38.1 13.21,35.05 12.87,34.72 F1.2
  Top 0.61: F1.2 14.4,32.34 15.62,31.11 22.86,31.11 23.62,31.88 25.74,31.88 27.01,33.15 Q1.3 27.05,34.16
VIN  (via drill 0.4)
  Top 0.254: RN4.3 32.4,40.79 31.88,40.26 v31.5,40.26 | v11.3,23.11 10.79,23.11 v9.65,21.97 | v11.18,19.43 11.18,17.91 13.21,15.88 13.21,12.95 12.95,12.7 10.67,12.7 8.89,10.92 8.89,7.11 10.67,5.33 12.95,5.33 15.89,8.27 C5.+
  Top 1.016: IC1.3 31.63,16.52 27.56,16.51 | 27.56,16.51 27.56,9.27 26.42,8.13 22.35,8.13 | JP3.4 27.56,19.05 27.56,16.51 | v22.86,2.16 22.35,2.16 | v21.84,2.16 22.35,2.16 | 22.35,2.16 22.35,5.84 22.1,6.1 D1.C 21.89,8.6 22.35,8.13 | C5.+ 17,8.13 22.35,8.13
  Bottom 0.254: v31.5,40.26 31.5,38.61 32.38,37.72 32.38,32.89 31.24,31.75 30.1,31.75 29.46,32.38 28.57,32.38 28.19,32 28.19,31.24 29.21,30.23 29.21,29.46 28.83,29.08 19.18,29.08 17.78,30.48 14.73,30.48 12.57,28.32 12.57,24.38 v11.3,23.11 | v9.65,21.97 11.18,20.45 v11.18,19.43
  Bottom 1.016: v21.84,2.16 v22.86,2.16 24.13,0.89 45.09,0.89 45.72,1.52 H2.8
WIZRST
  Top 0.203: IC2.2 40.23,19.19 IC6.59
WRXLED  (via drill 0.4)
  Top 0.203: IC6.72 46.89,28.54 47.12,28.32 v47.12,28.07 | RN1.2 43.45,22.37 v43.31,22.48
  Bottom 0.203: v43.31,22.48 43.56,22.73 43.56,26.67 45.38,28.49 46.94,28.49 47.11,28.32 v47.12,28.07
WTXLED  (via drill 0.4)
  Top 0.203: RN1.1 43,23.17 v42.8,23.37 | v48.01,28.45 47.51,28.94 IC6.73
  Bottom 0.203: v42.8,23.37 43.05,23.62 43.05,26.92 45.07,28.94 47.51,28.94 v48.01,28.45
XTLN
  Top 0.203: IC6.75 45.74,29.74 46.61,30.61 R3.2
  Top 0.305: R3.2 46.32,32.68 45.85,33.15 C16.1 45.72,33.27 44.96,34.04 44.96,38.61 X2.2
XTLP
  Top 0.203: IC6.76 44.23,30.14 44.83,30.73 R3.1
  Top 0.305: R3.1 44.83,31.24 44.83,32.64 44.32,33.15 44.32,33.44 | 43.31,33.4 C15.1 44.32,33.44 | 44.32,33.44 44.32,36.58 43.81,37.08 43.81,42.29 X2.1

## Text on the board
tPlace: USB | TX | RX | SCL | SDA | A | GND | 13 | 12 | 11 | 10 | 9 | 8 | 7 | 6 | 5 | 4 | 3 | 2 | 1 | 0 | REF | PWM | PWM | PWM | Digital | PWM | PWM | PWM | TX | RX | EtherTen R3 | www.freetronics.com | RST | RST-EN | PWR | D13 | 1 | 1 | ICSP | freetronics | A6 | A7 | TX | RX | COL | FDX | D2INT | 100 | LNK | PoE | 7-48V | 7-12V | DC | microSD | C | D | 2.1mm | IO | Power | Analog | SDA | SCL | REF | RST | 3V3 | 5V | GND | GND | VIN | 0 | 1 | 2 | 3 | 4 | 5
bPlace: SCL | SDA | A | GND | 13 | 12 | 11 | 10 | 9 | 8 | 7 | 6 | 5 | 4 | 3 | 2 | 1 | 0 | UBOOT | I2C | REF | PWM | PWM | PWM | Digital | PWM | PWM | PWM | TX | RX | GND | freetronics | EtherTen | v2.0 | R3 | www.freetronics.com/etherten | CC | ROHS | by Marc Alexander | SKU: | ETHERTEN | IO | Power | Analog | SDA | SCL | REF | RST | 3V3 | 5V | GND | GND | VIN | 0 | 1 | 2 | 3 | 4 | 5